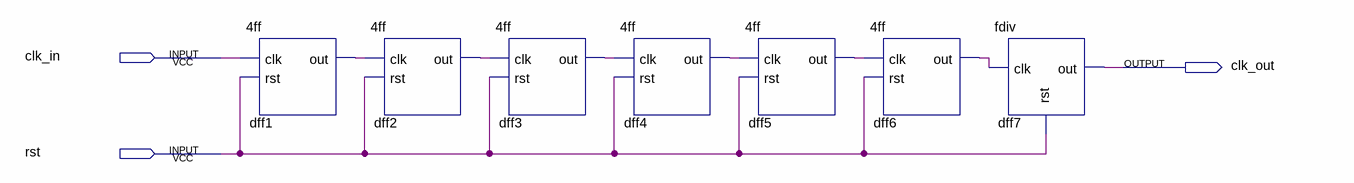
[diagram p0: schematic sheet]
// Quartus schematic fdivisor.bdf as structural Verilog: 7 symbols, 3 pins
module fdivisor (
  input  clk_in,
  input  rst,
  output clk_out
);

  wire dff1_out, dff2_out, dff3_out, dff4_out, dff5_out, dff6_out;

  \4ff  dff1 (.clk(clk_in), .rst(rst), .out(dff1_out));
  \4ff  dff2 (.clk(dff1_out), .rst(rst), .out(dff2_out));
  \4ff  dff3 (.clk(dff2_out), .rst(rst), .out(dff3_out));
  \4ff  dff4 (.clk(dff3_out), .rst(rst), .out(dff4_out));
  \4ff  dff5 (.clk(dff4_out), .rst(rst), .out(dff5_out));
  \4ff  dff6 (.clk(dff5_out), .rst(rst), .out(dff6_out));
  fdiv dff7 (.clk(dff6_out), .rst(rst), .out(clk_out));
endmodule
